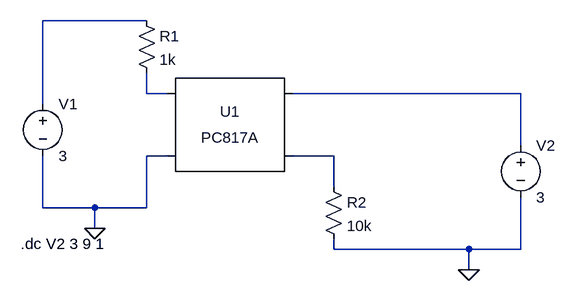
[diagram p0: schematic PC817.asc]
PC817.asc, the LTspice schematic file:
Version 4
SHEET 1 880 680
WIRE 16 16 -144 16
WIRE 16 128 16 96
WIRE 48 128 16 128
WIRE 592 128 240 128
WIRE -144 144 -144 16
WIRE 592 208 592 128
WIRE 48 224 16 224
WIRE 304 224 240 224
WIRE 304 272 304 224
WIRE -144 304 -144 224
WIRE -64 304 -144 304
WIRE 16 304 16 224
WIRE 16 304 -64 304
WIRE -64 336 -64 304
WIRE 304 368 304 352
WIRE 512 368 304 368
WIRE 592 368 592 288
WIRE 592 368 512 368
WIRE 512 400 512 368
FLAG -64 336 0
FLAG 512 400 0
SYMBOL Optos\\PC817A 144 176 R0
SYMATTR InstName U1
SYMBOL res 0 0 R0
SYMATTR InstName R1
SYMATTR Value 1k
SYMBOL voltage -144 128 R0
WINDOW 123 0 0 Left 0
WINDOW 39 0 0 Left 0
SYMATTR InstName V1
SYMATTR Value 3
SYMBOL voltage 592 192 R0
WINDOW 123 0 0 Left 0
WINDOW 39 0 0 Left 0
SYMATTR InstName V2
SYMATTR Value 3
SYMBOL res 288 256 R0
SYMATTR InstName R2
SYMATTR Value 10k
TEXT -178 360 Left 2 !.dc V2 3 9 1

The netlist it stands for:
* PC817.asc
XU1 N002 0 N003 N004 PC817 Igain=1m
R1 N001 N002 1k
V1 N001 0 3
V2 N003 0 3
R2 N004 0 10k
.dc V2 3 9 1
.lib PC817.sub
.backanno
.end